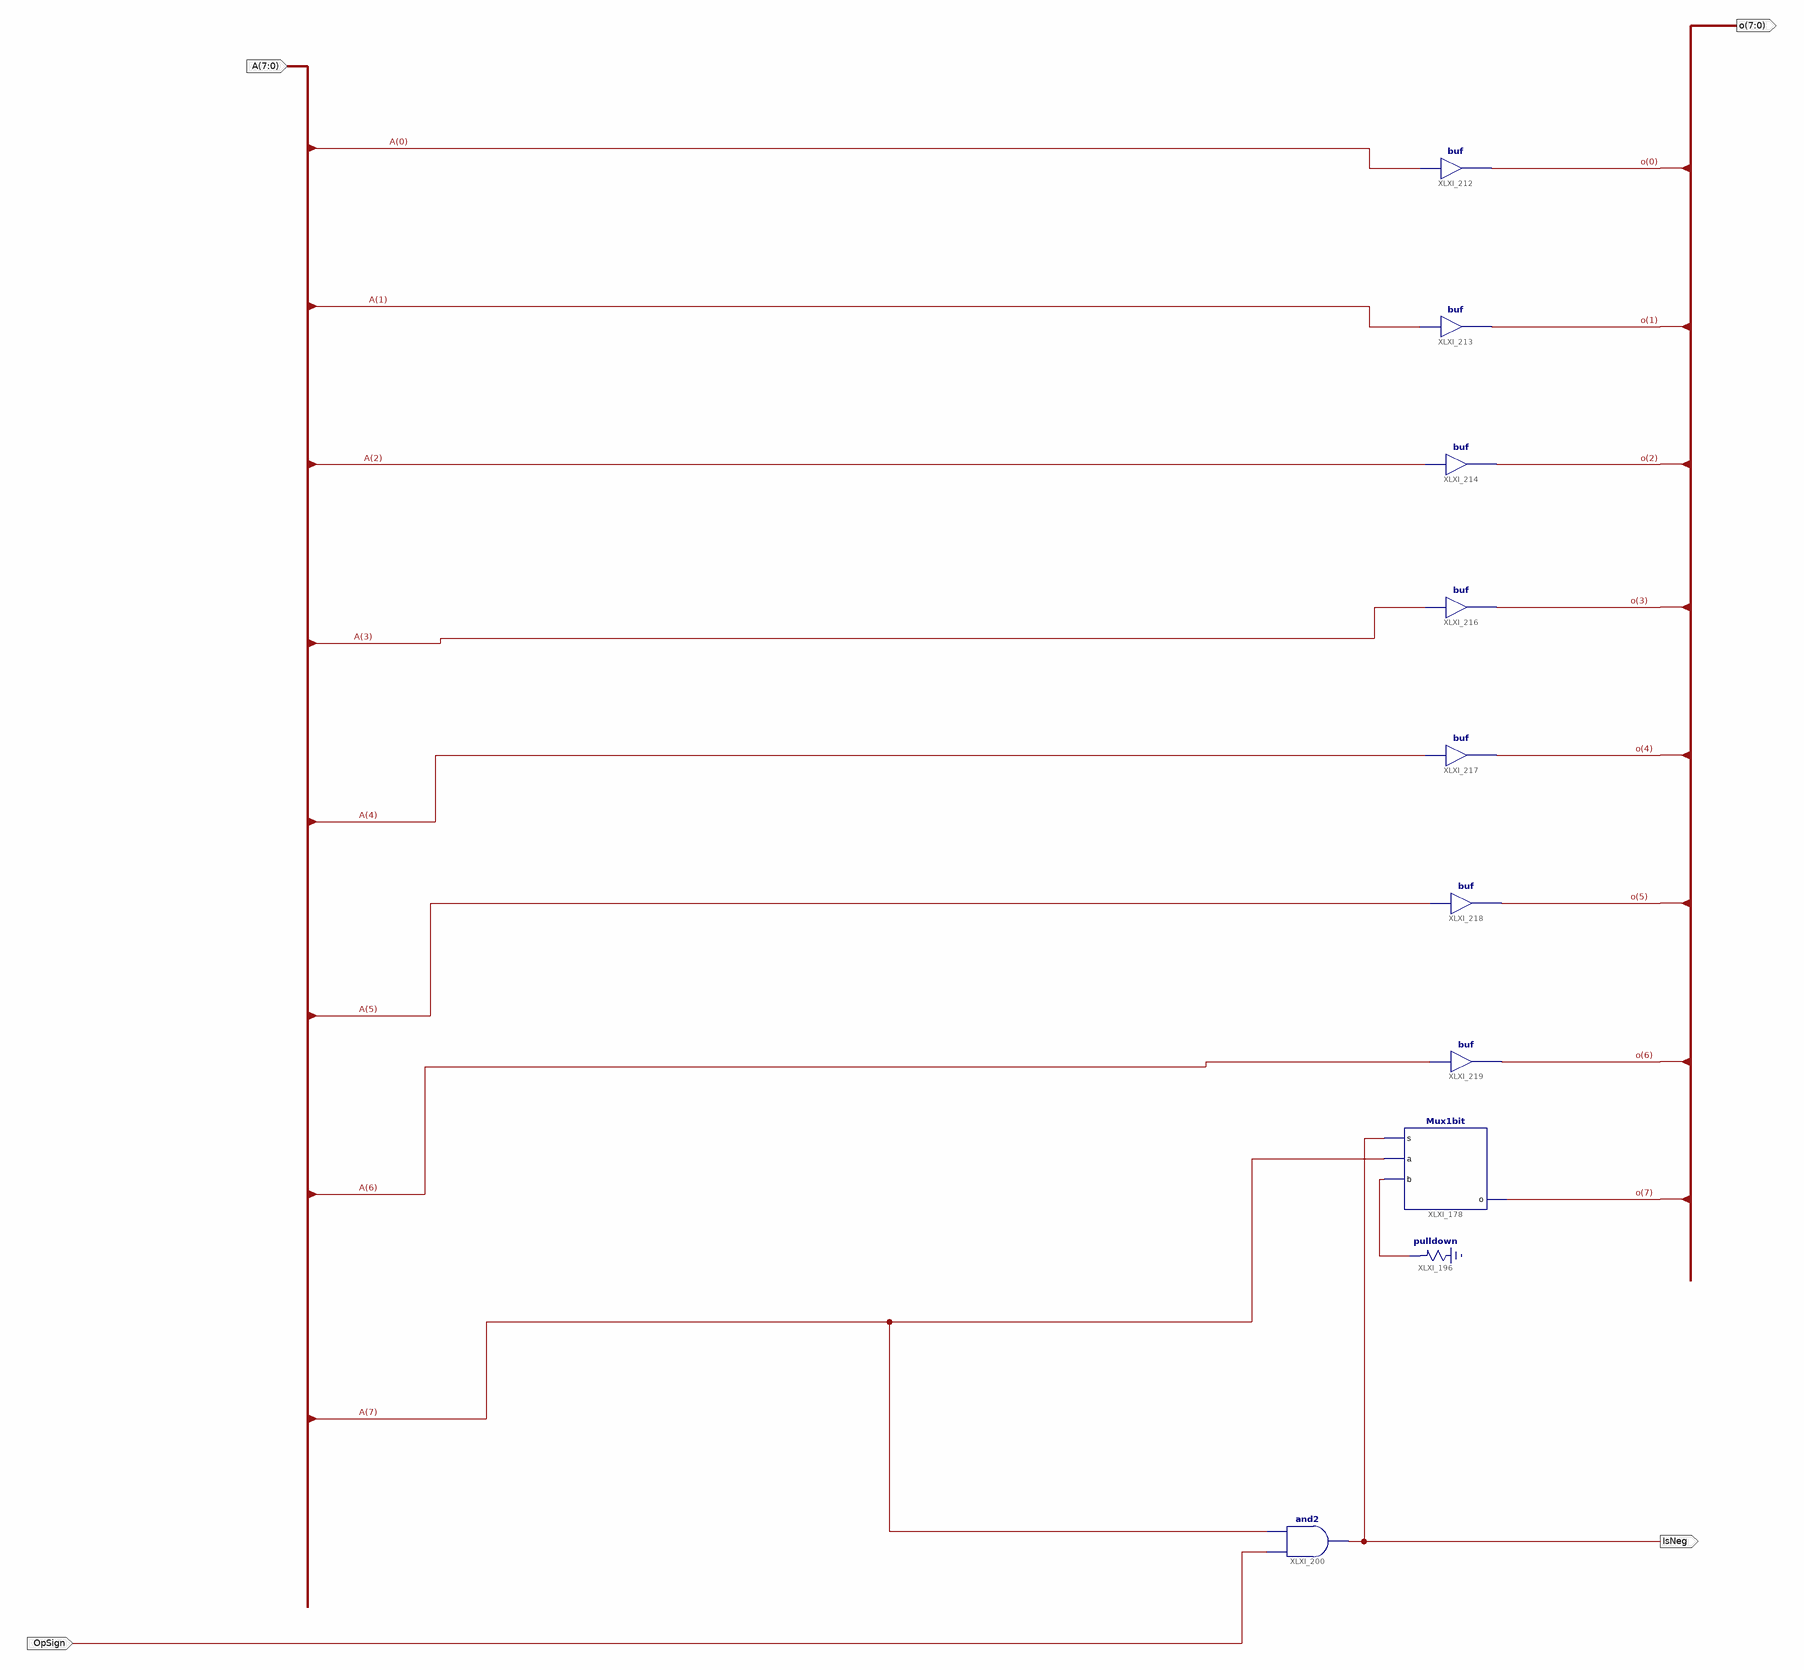
[diagram p0: schematic sheet 1]
// Xilinx ISE schematic CorrectDisplay.sch (spartan3e) as structural Verilog: 10 symbols, 4 ports
module CorrectDisplay (
  input  [7:0] A,
  input  OpSign,
  output [7:0] o,
  output IsNeg
);

  wire XLXN_455;

  Mux1bit XLXI_178 (.s(IsNeg), .b(XLXN_455), .a(A[7]), .o(o[7]));
  \pulldown  XLXI_196 (.O(XLXN_455));
  and XLXI_200 (IsNeg, OpSign, A[7]);
  buf XLXI_212 (o[0], A[0]);
  buf XLXI_213 (o[1], A[1]);
  buf XLXI_214 (o[2], A[2]);
  buf XLXI_216 (o[3], A[3]);
  buf XLXI_217 (o[4], A[4]);
  buf XLXI_218 (o[5], A[5]);
  buf XLXI_219 (o[6], A[6]);
endmodule
